# EAGLE design Charger Board_2 (EAGLE 6.3)
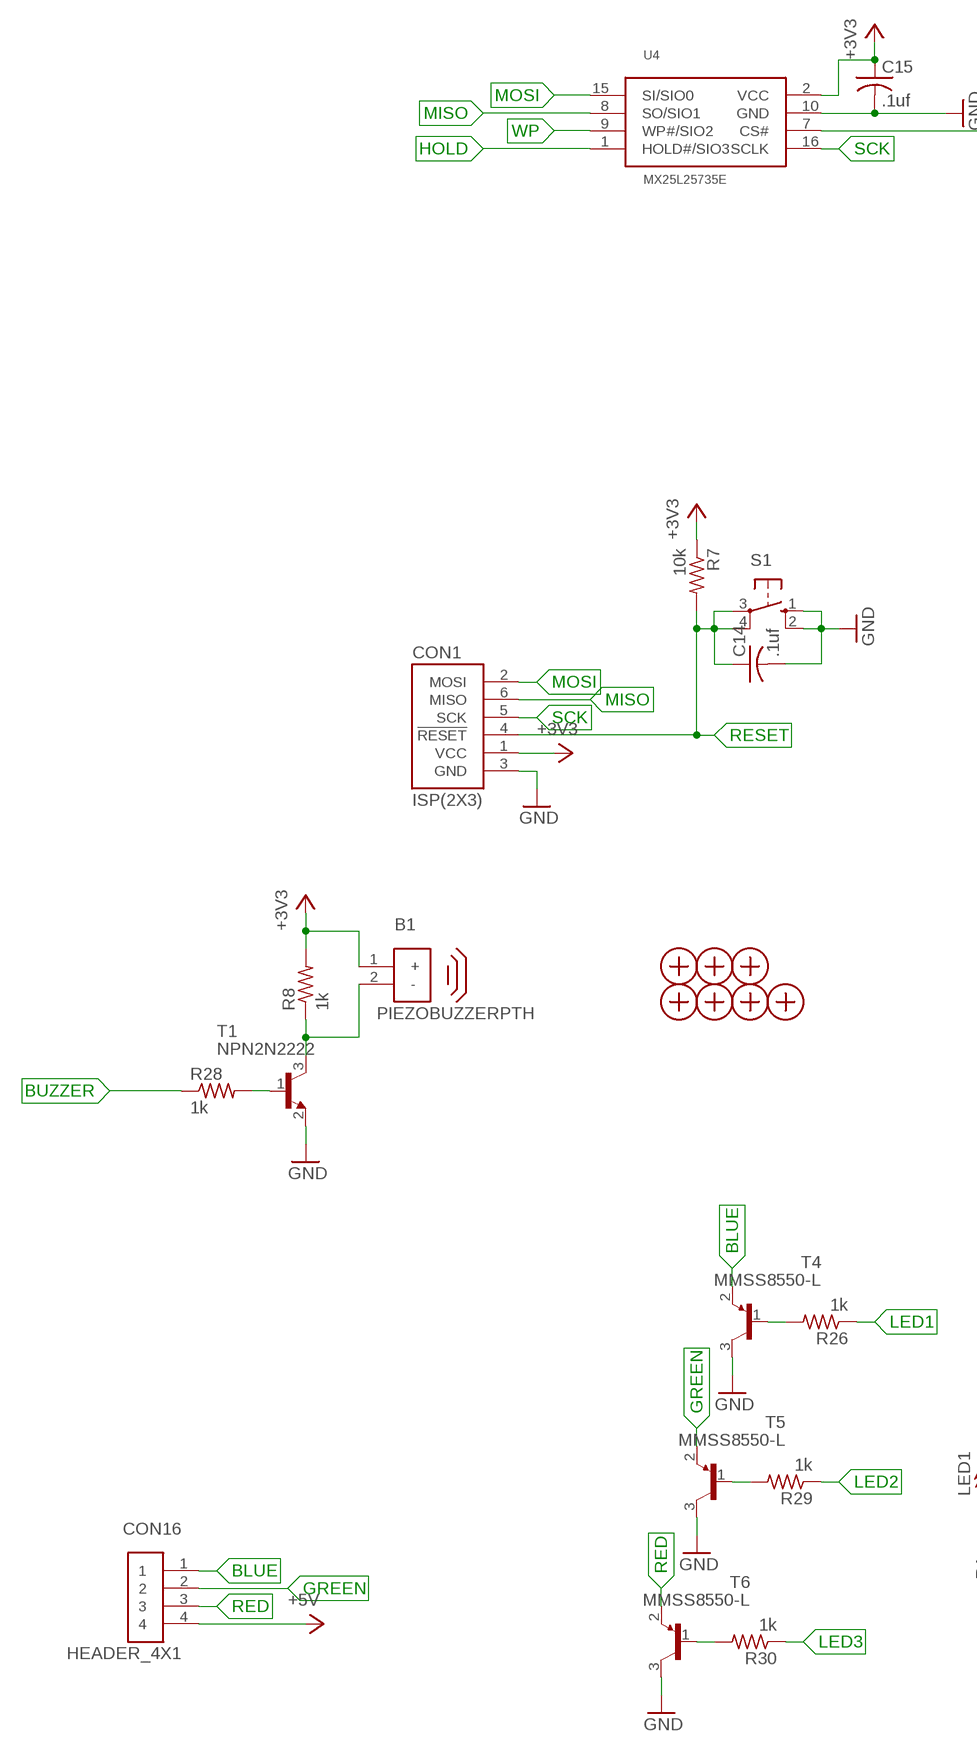
[diagram p0: schematic, sheet 1, part 1 of 2]
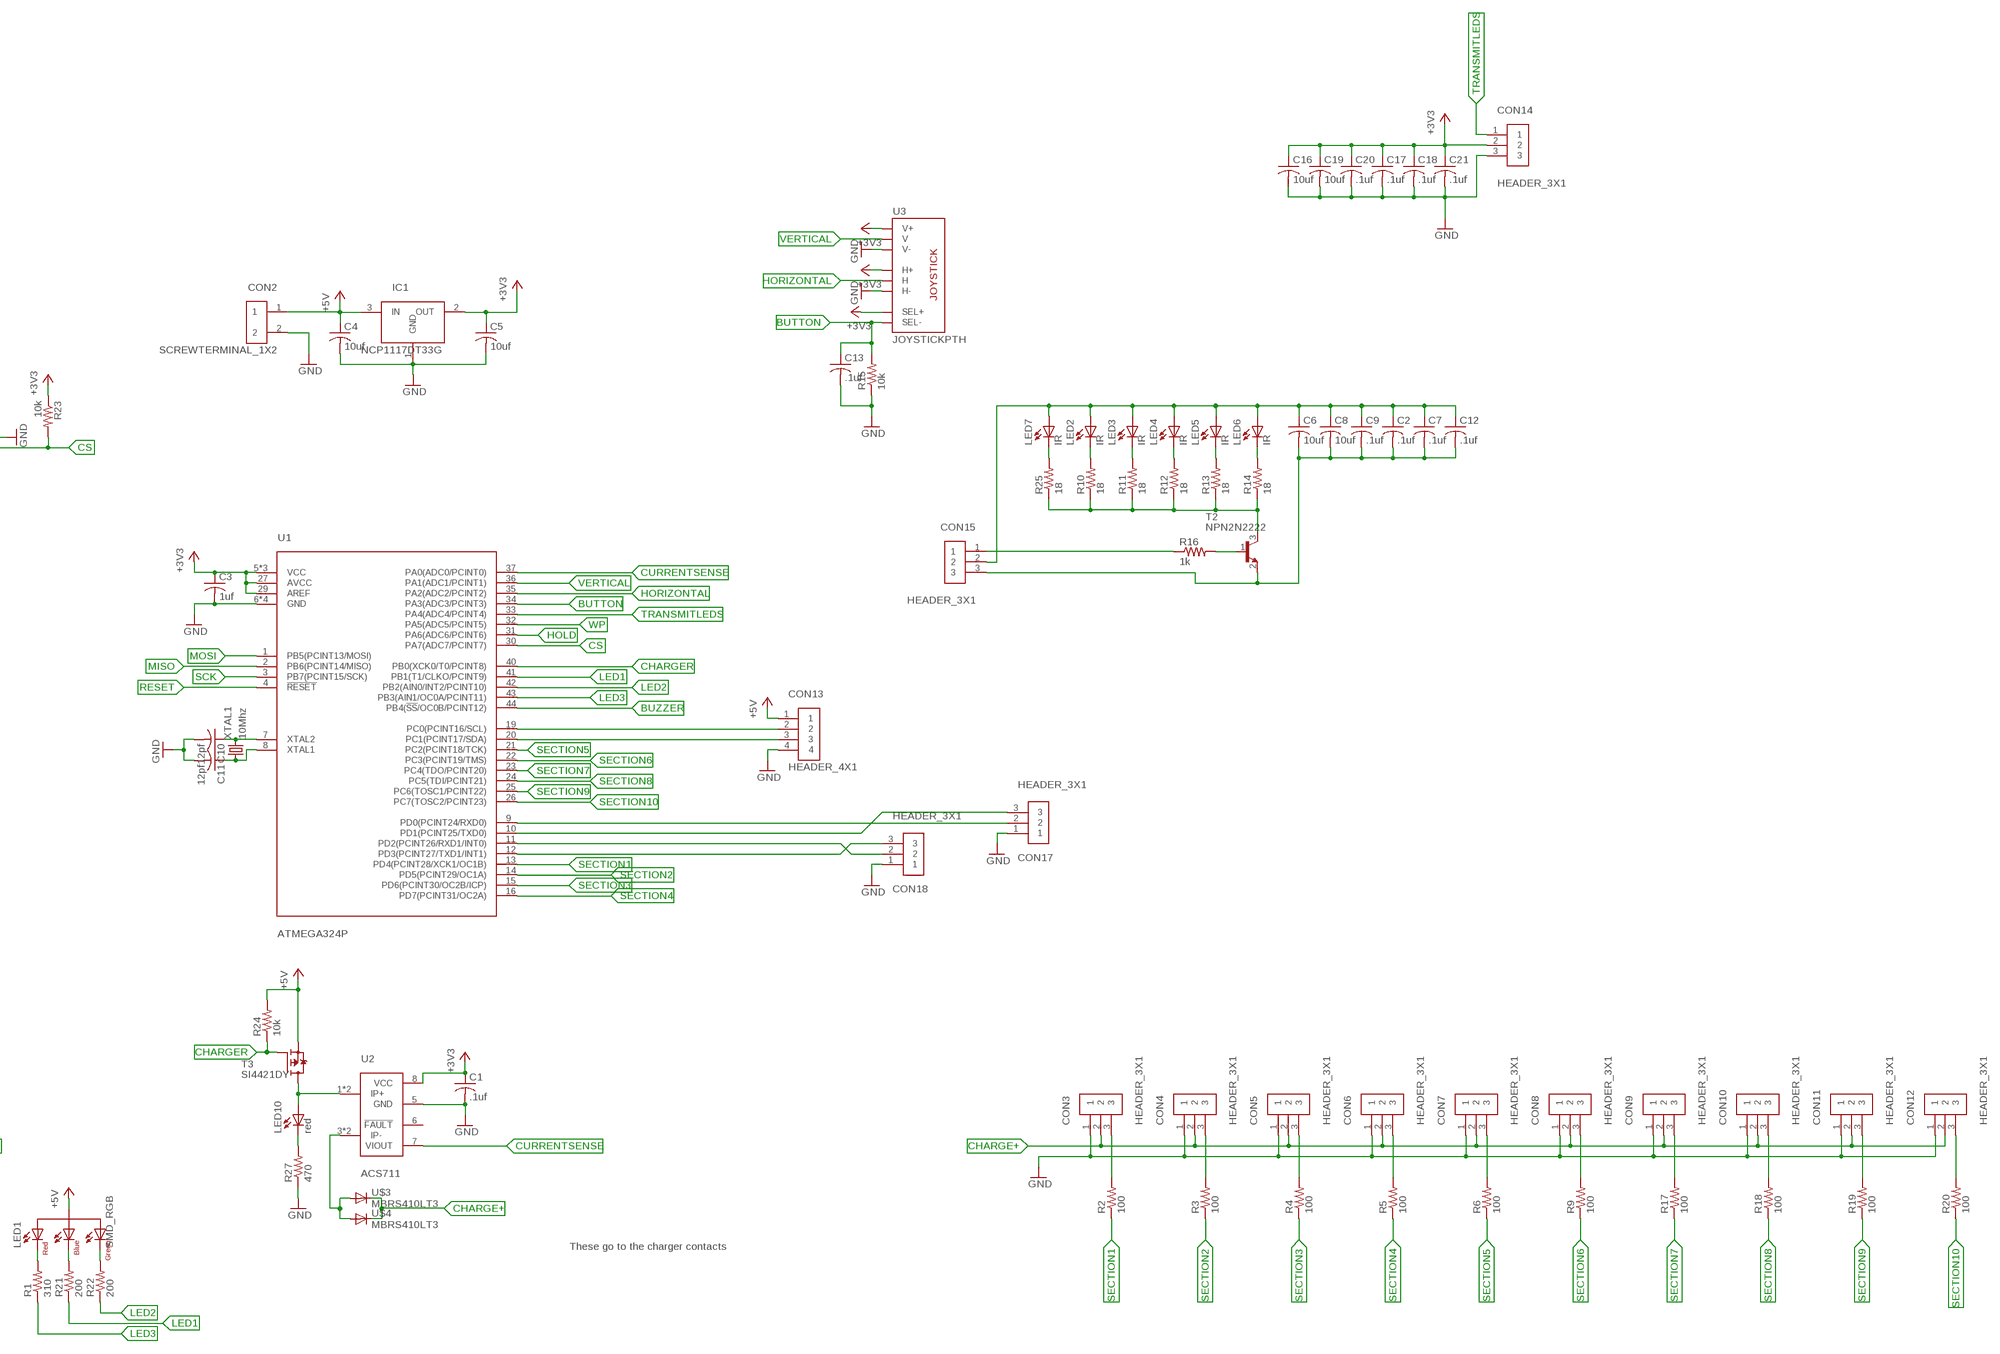
[diagram p1: schematic, sheet 1, part 2 of 2]

## Parts
B1  PIEZOBUZZERPTH  [PIEZOBUZZER]
C1  .1uf  CAP0603  [0603]
C2  .1uf  CAP0603  [0603]
C3  1uf  CAP0603  [0603]
C4  10uf  CAP0805  [0805]
C5  10uf  CAP0805  [0805]
C6  10uf  CAP0805  [0805]
C7  .1uf  CAP0603  [0603]
C8  10uf  CAP0805  [0805]
C9  .1uf  CAP0603  [0603]
C10  12pf  CAP0603  [0603]
C11  12pf  CAP0603  [0603]
C12  .1uf  CAP0603  [0603]
C13  .1uf  CAP0603  [0603]
C14  .1uf  CAP0603  [0603]
C15  .1uf  CAP0603  [0603]
C16  10uf  CAP0805  [0805]
C17  .1uf  CAP0603  [0603]
C18  .1uf  CAP0603  [0603]
C19  10uf  CAP0805  [0805]
C20  .1uf  CAP0603  [0603]
C21  .1uf  CAP0603  [0603]
CON1  ISP(2X3)  [PINHEADER(2X3)]
CON2  SCREWTERMINAL_1X2  [SCREWTERMINAL_1X2]
CON3  HEADER_3X1  [3PINHEADER_.100"]
CON4  HEADER_3X1  [3PINHEADER_.100"]
CON5  HEADER_3X1  [3PINHEADER_.100"]
CON6  HEADER_3X1  [3PINHEADER_.100"]
CON7  HEADER_3X1  [3PINHEADER_.100"]
CON8  HEADER_3X1  [3PINHEADER_.100"]
CON9  HEADER_3X1  [3PINHEADER_.100"]
CON10  HEADER_3X1  [3PINHEADER_.100"]
CON11  HEADER_3X1  [3PINHEADER_.100"]
CON12  HEADER_3X1  [3PINHEADER_.100"]
CON13  HEADER_4X1  [4PINHEADER_.100"]
CON14  HEADER_3X1  [3PINHEADER_.100"]
CON15  HEADER_3X1  [3PINHEADER_.100"]
CON16  HEADER_4X1  [4PINHEADER_.100"]
CON17  HEADER_3X1  [3PINHEADER_.100"]
CON18  HEADER_3X1  [3PINHEADER_.100"]
H1  MOUNTINGHOLE  [MOUNTINGHOLE]
H2  MOUNTINGHOLE  [MOUNTINGHOLE]
H3  MOUNTINGHOLE  [MOUNTINGHOLE]
H4  MOUNTINGHOLE  [MOUNTINGHOLE]
H5  MOUNTINGHOLE  [MOUNTINGHOLE]
H6  MOUNTINGHOLE  [MOUNTINGHOLE]
H7  MOUNTINGHOLE  [MOUNTINGHOLE]
IC1  NCP1117DT33G  [DPAK]
LED1  SMD_RGB  [PLCC4]
LED2  IR  LED5MMRA  [5MM_LED_RA]
LED3  IR  LED5MMRA  [5MM_LED_RA]
LED4  IR  LED5MMRA  [5MM_LED_RA]
LED5  IR  LED5MMRA  [5MM_LED_RA]
LED6  IR  LED5MMRA  [5MM_LED_RA]
LED7  IR  LED5MMRA  [5MM_LED_RA]
LED10  red  LED0603  [LED0603]
R1  310  RES0603  [0603]
R2  100  RES0603  [0603]
R3  100  RES0603  [0603]
R4  100  RES0603  [0603]
R5  100  RES0603  [0603]
R6  100  RES0603  [0603]
R7  10k  RES0603  [0603]
R8  1k  RES0603  [0603]
R9  100  RES0603  [0603]
R10  18  RES0603  [0603]
R11  18  RES0603  [0603]
R12  18  RES0603  [0603]
R13  18  RES0603  [0603]
R14  18  RES0603  [0603]
R15  10k  RES0603  [0603]
R16  1k  RES0603  [0603]
R17  100  RES0603  [0603]
R18  100  RES0603  [0603]
R19  100  RES0603  [0603]
R20  100  RES0603  [0603]
R21  200  RES0603  [0603]
R22  200  RES0603  [0603]
R23  10k  RES0603  [0603]
R24  10k  RES0603  [0603]
R25  18  RES0603  [0603]
R26  1k  RES0603  [0603]
R27  470  RES0603  [0603]
R28  1k  RES0603  [0603]
R29  1k  RES0603  [0603]
R30  1k  RES0603  [0603]
S1  10-XX  [B3F-10XX]
T1  NPN2N2222  [SOT23]
T2  NPN2N2222  [SOT23]
T3  SI4421DY  [S0-8]
T4  MMSS8550-L  [SOT23]
T5  MMSS8550-L  [SOT23]
T6  MMSS8550-L  [SOT23]
U1  ATMEGA324P  [TQFP44]
U2  ACS711  [8SOIC]
U3  JOYSTICKPTH  [JOYSTICK]
U4  MX25L25735E  [SOIC16R]
U$3  MBRS410LT3  [SMD_DIODE]
U$4  MBRS410LT3  [SMD_DIODE]
XTAL1  10Mhz  NX5032GA-10.000000MHZ  [SMDXTAL]

## Nets
+3V3: B1.1(+) C1.1 C3.1 C5.1 C15.1 C16.1 C17.1 C18.1 C19.1 C20.1 C21.1 CON1.1(VCC) CON14.2 IC1.2(OUT) R7.1 R8.2 R23.1 U1.5(VCC) U1.17(VCC) U1.27(AVCC) U1.29(AREF) U1.38(VCC) U2.8(VCC) U3.B1A(SEL+) U3.H1(H+) U3.V1(V+) U4.2(VCC)
+5V: C4.1 CON2.1 CON13.1 CON16.4 IC1.3(IN) LED1.2(COMMONANODE) R24.2 T3.1(S) T3.2(S) T3.3(S)
BLUE: CON16.1 T4.2(E)
BUTTON: C13.1 R15.2 U1.34(PA3(ADC3/PCINT3)) U3.B2A(SEL-)
BUZZER: R28.1 U1.44(PB4(!SS!/OC0B/PCINT12))
CHARGE+: CON3.2 CON4.2 CON5.2 CON6.2 CON7.2 CON8.2 CON9.2 CON10.2 CON11.2 CON12.2 U$3.2(C) U$4.2(C)
CHARGER: R24.1 T3.4(G) U1.40(PB0(XCK0/T0/PCINT8))
CS: R23.2 U1.30(PA7(ADC7/PCINT7)) U4.7(CS#)
CURRENTSENSE: U1.37(PA0(ADC0/PCINT0)) U2.7(VIOUT)
GND: C1.2 C3.2 C4.2 C5.2 C10.2 C11.2 C13.2 C14.2 C15.2 C16.2 C17.2 C18.2 C19.2 C20.2 C21.2 CON1.3(GND) CON2.2 CON3.1 CON4.1 CON5.1 CON6.1 CON7.1 CON8.1 CON9.1 CON10.1 CON11.1 CON12.1 CON13.4 CON14.3 CON17.1 CON18.1 IC1.1(GND) R15.1 R27.1 S1.1(S) S1.2(S1) T1.2(E) T4.3(C) T5.3(C) T6.3(C) U1.6(GND) U1.18(GND) U1.28(GND) U1.39(GND) U2.5(GND) U3.H3(H-) U3.V3(V-) U4.10(GND)
GREEN: CON16.2 T5.2(E)
HOLD: U1.31(PA6(ADC6/PCINT6)) U4.1(HOLD#/SIO3)
HORIZONTAL: U1.35(PA2(ADC2/PCINT2)) U3.H2(H)
LED1: R21.1 R26.1 U1.41(PB1(T1/CLKO/PCINT9))
LED2: R22.1 R29.1 U1.42(PB2(AIN0/INT2/PCINT10))
LED3: R1.1 R30.1 U1.43(PB3(AIN1/OC0A/PCINT11))
MISO: CON1.6(MISO) U1.2(PB6(PCINT14/MISO)) U4.8(SO/SIO1)
MOSI: CON1.2(MOSI) U1.1(PB5(PCINT13/MOSI)) U4.15(SI/SIO0)
N$1: LED10.2(A) T3.5(D) T3.6(D) T3.7(D) T3.8(D) U2.1(IP+) U2.2(IP+)
N$2: CON15.1 R16.1
N$3: C2.1 C6.1 C7.1 C8.1 C9.1 C12.1 CON15.2 LED2.1(A) LED3.1(A) LED4.1(A) LED5.1(A) LED6.1(A) LED7.1(A)
N$4: CON18.2 U1.11(PD2(PCINT26/RXD1/INT0))
N$5: C2.2 C6.2 C7.2 C8.2 C9.2 C12.2 CON15.3 T2.2(E)
N$6: LED7.2(C) R25.2
N$7: CON17.3 U1.10(PD1(PCINT25/TXD0))
N$8: CON17.2 U1.9(PD0(PCINT24/RXD0))
N$9: B1.2(-) R8.1 T1.3(C)
N$10: R10.1 R11.1 R12.1 R13.1 R14.1 R25.1 T2.3(C)
N$11: R16.2 T2.1(B)
N$12: C10.1 U1.7(XTAL2) XTAL1.2
N$13: LED2.2(C) R10.2
N$14: LED3.2(C) R11.2
N$15: LED4.2(C) R12.2
N$16: LED5.2(C) R13.2
N$17: LED6.2(C) R14.2
N$19: CON18.3 U1.12(PD3(PCINT27/TXD1/INT1))
N$22: LED10.1(C) R27.2
N$23: U2.3(IP-) U2.4(IP-) U$3.1(A) U$4.1(A)
N$24: CON3.3 R2.2
N$25: C11.1 U1.8(XTAL1) XTAL1.1
N$26: R28.2 T1.1(B)
N$27: CON4.3 R3.2
N$28: CON5.3 R4.2
N$29: CON6.3 R5.2
N$30: CON7.3 R6.2
N$31: CON8.3 R9.2
N$32: CON9.3 R17.2
N$33: CON10.3 R18.2
N$34: CON11.3 R19.2
N$35: CON12.3 R20.2
N$36: R26.2 T4.1(B)
N$37: LED1.1(REDCATHODE) R1.2
N$38: LED1.3(BLUECATHODE) R21.2
N$39: LED1.4(GREENCATHODE) R22.2
N$40: R29.2 T5.1(B)
N$41: R30.2 T6.1(B)
RED: CON16.3 T6.2(E)
RESET: C14.1 CON1.4(!RESET) R7.2 S1.3(P) S1.4(P1) U1.4(!RESET)
SCK: CON1.5(SCK) U1.3(PB7(PCINT15/SCK)) U4.16(SCLK)
SCL: CON13.2 U1.19(PC0(PCINT16/SCL))
SDA: CON13.3 U1.20(PC1(PCINT17/SDA))
SECTION1: R2.1 U1.13(PD4(PCINT28/XCK1/OC1B))
SECTION2: R3.1 U1.14(PD5(PCINT29/OC1A))
SECTION3: R4.1 U1.15(PD6(PCINT30/OC2B/ICP))
SECTION4: R5.1 U1.16(PD7(PCINT31/OC2A))
SECTION5: R6.1 U1.21(PC2(PCINT18/TCK))
SECTION6: R9.1 U1.22(PC3(PCINT19/TMS))
SECTION7: R17.1 U1.23(PC4(TDO/PCINT20))
SECTION8: R18.1 U1.24(PC5(TDI/PCINT21))
SECTION9: R19.1 U1.25(PC6(TOSC1/PCINT22))
SECTION10: R20.1 U1.26(PC7(TOSC2/PCINT23))
TRANSMITLEDS: CON14.1 U1.33(PA4(ADC4/PCINT4))
VERTICAL: U1.36(PA1(ADC1/PCINT1)) U3.V2(V)
WP: U1.32(PA5(ADC5/PCINT5)) U4.9(WP#/SIO2)
Unconnected: U2.6(!FAULT)

## Notes on the sheet
- These go to the charger contacts

## Library data of the parts
B1 = Passive:PIEZOBUZZER: Digikey Part Number: 445-2525-1-ND Manufacturer Part Number: PS1240P02BT
C1-C21 = Passive:CAP
CON1 = Mechanical:ISP
CON2 = Mechanical:SCREWTERMINAL_1X2: Digikey Part Number: ED1631-ND Manufacturer Part Number: ED700/2
CON3-CON12 CON14 CON15 CON17 CON18 = Mechanical:HEADER_3X1
CON13 CON16 = Mechanical:HEADER_4X1
H1-H7 = Mechanical:MOUNTINGHOLE
IC1 = PowerIC:NCP1117DT33G: Digikey Part Number: NCP1117DT33GOS-ND Manufacturer Part Number: NCP1117DT33G
LED1 = Passive:SMD_RGB: Digikey Part Number: CLVBA-FKA-CAEDH8BBB7A363CT-ND Manufacturer Part Number: CLVBA-FKA-CAEDH8BBB7A363
LED2-LED7 LED10 = Passive:LED
R1-R30 = Passive:RES
S1 = switch-omron:10-XX: OMRON SWITCH; MPN: B3F-1000; OC_FARNELL: 176432; OC_NEWARK: 36M3542
T1 T2 = Passive:NPN2N2222: Digikey Part Number: 568-1738-1-ND Manufacturer Part Number: PMBT2222A,215
T3 = Passive:SI4421DY: Digikey Part Number: SI4421DY-T1-E3CT-ND Manufacturer Part Number: SI4421DY-T1-E3
T4-T6 = Passive:MMSS8550-L: Manufacturer Part Number: MMSS8550-L-TP Digikey Part Number: MMSS8550-L-TPMSCT-ND
U1 = DigitalIC:ATMEGA324P: Digikey Part Number: ATMEGA324P-20AU-ND Manufacturer Part Number: ATMEGA324P-20AU
U2 = PowerIC:ACS711
U3 = SparkFun:JOYSTICK: Thumb Joystick Joystick commonly found in PS2 controllers. Two pots and a select switch. Footprint proven. Spark Fun Electronics SKU : COM-09032
U4 = DigitalIC:MX25L25735E: Digikey Part Number: 1092-1000-ND Manufacturer Part Number: MX25L25735EMI-12G
U$3 U$4 = Passive:MBRS410LT3: Digikey Part Number: MBRS410LT3GOSCT-ND Manufacturer Part Number: MBRS410LT3G
XTAL1 = Passive:NX5032GA-10.000000MHZ: Digikey Part Number: 644-1033-1-ND Manufacturer Part Number: NX5032GA-10.000000MHZ-LN-CD-1

## Board
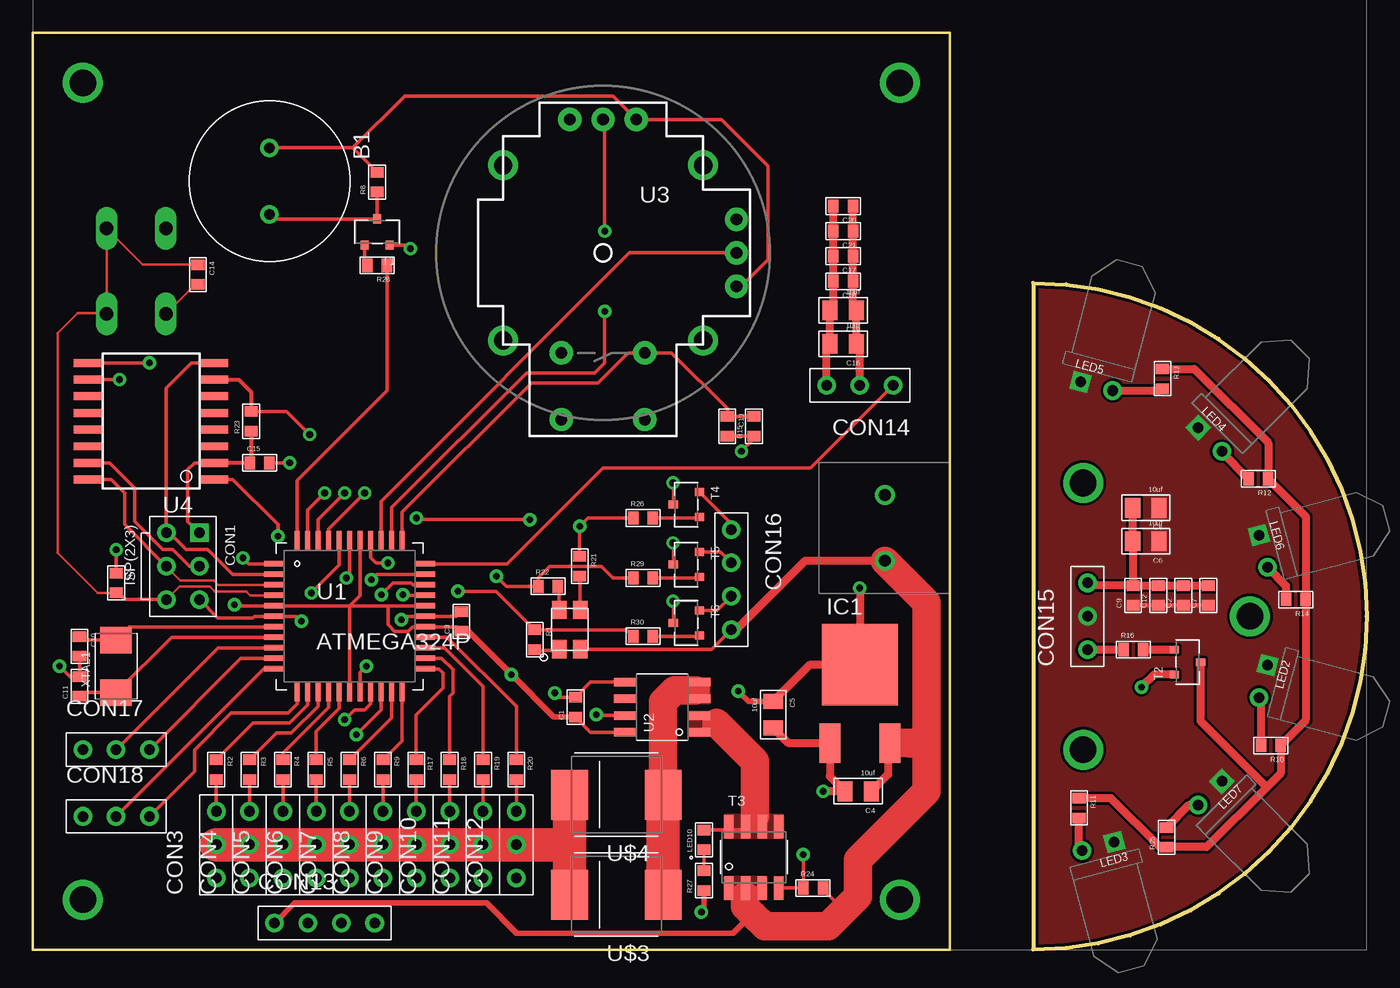
[diagram p2: board, top side]
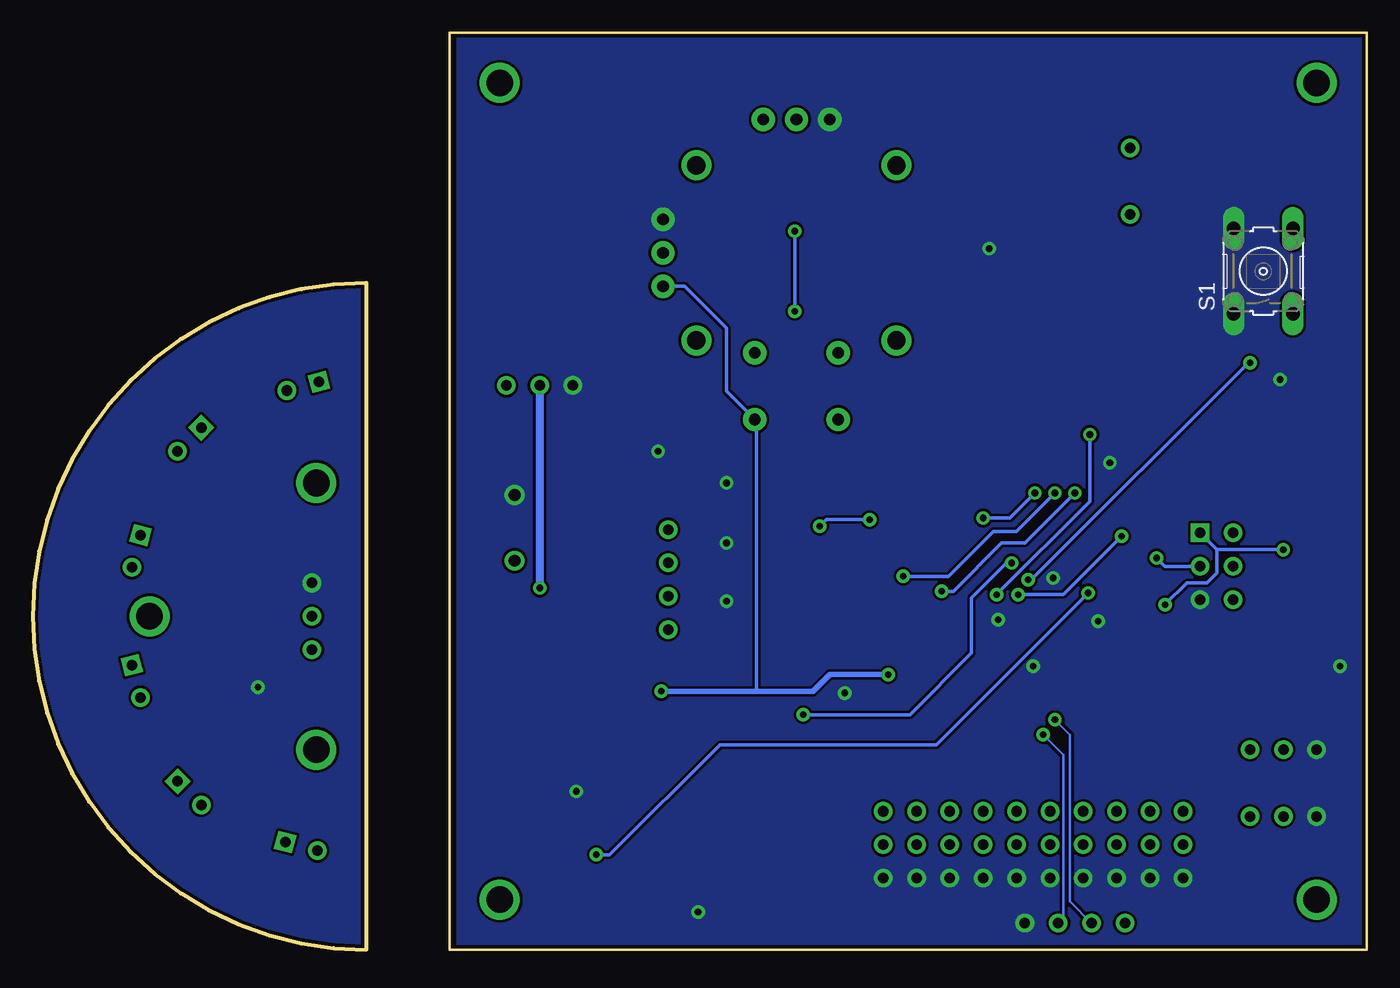
[diagram p3: board, bottom side, seen from below]

Size 101.6 x 69.85 mm. Coordinates in mm from the lower left corner, seen from the top.
Outline: 76.2,50.8 arc-180 76.2,0 76.2,50.8
Outline: 0,0 0,69.85 69.85,69.85 69.85,0 0,0
Copper layers (1*16): Top 0.035mm / dielectric 1.5mm / Bottom 0.035mm
Design rules: minimum track width 8mil, minimum drill 20mil, track to track 8mil, track to pad 8mil, pad to pad 8mil, via to via 8mil, smd to smd 8mil, copper to edge 10mil, drill to drill 8mil, minimum pad ring 12mil, minimum via ring 10mil, stop-mask expansion 4mil, vias tented up to drill 25mil, thermal gap 10mil

### Footprints (pad centres in the part's own frame; a part is rotated, then mirrored left to right if it is on the bottom)
PIEZOBUZZER = drill 0.8: 1 -2.54,0; 2 2.54,0
0603 = smd 0.8 x 1: 1 -0.75,0; 2 0.75,0
0805 = smd 1.15 x 1.5: 1 -1,0; 2 1,0
PINHEADER(2X3) = drill 0.8 square: 1 -2.54,1.27 | drill 0.8: 2 0,1.27; 3 2.54,1.27; 4 2.54,-1.27; 5 0,-1.27; 6 -2.54,-1.27
SCREWTERMINAL_1X2 = drill 0.9: 1 -2.5,0; 2 2.5,0
3PINHEADER_.100" = drill 0.8: 1 -2.54,0; 2 0,0; 3 2.54,0
4PINHEADER_.100" = drill 0.8: 1 -2.54,0; 2 0,0; 3 2.54,0; 4 5.08,0
MOUNTINGHOLE = drill 2.032 pad 2.286: P$2 0,0
DPAK = smd 1.6 x 3: 1 -2.28,-5.99; 3 2.28,-5.99 | smd 5.8 x 6.2: 2 0,0
PLCC4 = smd 1.4 x 1.1: 1 -1.5,0.8; 2 -1.5,-0.8; 3 1.5,-0.8; 4 1.5,0.8
5MM_LED_RA = drill 0.8 square: 1 -1.27,0 | drill 0.8: 2 1.27,0
LED0603 = smd 0.8 x 1: 1 -0.75,0; 2 0.75,0
B3F-10XX = drill 1.016 long: 1 -3.251,2.261; 2 3.251,2.261; 3 -3.251,-2.261; 4 3.251,-2.261
SOT23 = smd 0.6 x 0.7: 1 0.95,1; 2 -0.95,1; 3 0,-1
S0-8 = smd 0.72 x 1.78: 1 -1.905,-2.34; 2 -0.635,-2.34; 3 0.635,-2.34; 4 1.905,-2.34; 5 1.905,2.34; 6 0.635,2.34; 7 -0.635,2.34; 8 -1.905,2.34
TQFP44 = smd 1.5 x 0.406: 1 -5.75,4; 2 -5.75,3.2; 3 -5.75,2.4; 4 -5.75,1.6; 5 -5.75,0.8; 6 -5.75,0; 7 -5.75,-0.8; 8 -5.75,-1.6; 9 -5.75,-2.4; 10 -5.75,-3.2; 11 -5.75,-4; 23 5.75,-4; 24 5.75,-3.2; 25 5.75,-2.4; 26 5.75,-1.6; 27 5.75,-0.8; 28 5.75,0; 29 5.75,0.8; 30 5.75,1.6; 31 5.75,2.4; 32 5.75,3.2; 33 5.75,4 | smd 0.406 x 1.5: 12 -4,-5.75; 13 -3.2,-5.75; 14 -2.4,-5.75; 15 -1.6,-5.75; 16 -0.8,-5.75; 17 0,-5.75; 18 0.8,-5.75; 19 1.6,-5.75; 20 2.4,-5.75; 21 3.2,-5.75; 22 4,-5.75; 34 4,5.75; 35 3.2,5.75; 36 2.4,5.75; 37 1.6,5.75; 38 0.8,5.75; 39 0,5.75; 40 -0.8,5.75; 41 -1.6,5.75; 42 -2.4,5.75; 43 -3.2,5.75; 44 -4,5.75
8SOIC = smd 0.65 x 1.75: 1 -1.905,-2.8; 2 -0.635,-2.8; 3 0.635,-2.8; 4 1.905,-2.8; 5 1.905,2.8; 6 0.635,2.8; 7 -0.635,2.8; 8 -1.905,2.8
JOYSTICK = drill 0.9 pad 1.778: B1A -3.175,12.7; B1B 3.175,12.7; B2A -3.175,7.62; B2B 3.175,7.62 | drill 0.889 pad 1.778: H1 -2.54,-10.16; H2 0,-10.16; H3 2.54,-10.16; V1 -10.16,2.54; V2 -10.16,0; V3 -10.16,-2.54 | drill 1.397 pad 2.286: MOUNT1 -7.62,6.668; MOUNT2 -7.62,-6.668; MOUNT3 7.62,-6.668; MOUNT4 7.62,6.668
SOIC16R = smd 0.6 x 2.2: 1 -4.445,-4.775; 2 -3.175,-4.775; 3 -1.905,-4.775; 4 -0.635,-4.775; 5 0.635,-4.775; 6 1.905,-4.775; 7 3.175,-4.775; 8 4.445,-4.775; 9 4.445,4.8; 10 3.175,4.8; 11 1.905,4.8; 12 0.635,4.8; 13 -0.635,4.8; 14 -1.905,4.8; 15 -3.175,4.8; 16 -4.445,4.8
SMD_DIODE = smd 2.794 x 3.81: 1 -3.568,0; 2 3.568,0
SMDXTAL = smd 2 x 2.4: 1 -2,0; 2 2,0

### Placement (x,y rotation side)
B1  18.03,58.55 270 top
C1  41.34,18.48 90 top
C2  87.63,26.99 90 top
C3  32.64,25.02 90 top
C4  62.87,12.06 180 top
C5  56.39,17.91 270 top
C6  84.77,31.11 180 top
C7  89.53,26.99 90 top
C8  84.77,33.66 180 top
C9  83.82,26.99 90 top
C10  3.56,23.11 270 top
C11  3.56,20.07 90 top
C12  85.72,26.99 90 top
C13  52.9,39.88 270 top
C14  12.57,51.44 270 top
C15  17.27,37.08 0 top
C16  61.72,46.16 180 top
C17  61.72,52.83 180 top
C18  61.72,50.93 180 top
C19  61.72,48.7 180 top
C20  61.72,56.64 180 top
C21  61.72,54.74 180 top
CON1  11.43,29.21 270 top
CON2  64.9,32.13 90 top
CON3  13.97,8 90 top
CON4  16.51,8 90 top
CON5  19.05,8 90 top
CON6  21.59,8 90 top
CON7  24.13,8 90 top
CON8  26.67,8 90 top
CON9  29.21,8 90 top
CON10  31.75,8 90 top
CON11  34.29,8 90 top
CON12  36.83,8 90 top
CON13  20.95,2.03 0 top
CON14  62.99,42.99 180 top
CON15  80.33,25.4 90 top
CON16  53.21,29.46 270 top
CON17  6.35,15.24 0 top
CON18  6.35,10.16 0 top
H1  3.81,3.81 0 top
H2  3.81,66.04 0 top
H3  66.04,66.04 0 top
H4  66.04,3.81 0 top
H5  80.01,35.56 0 top
H6  80.01,15.24 0 top
H7  92.71,25.4 0 top
IC1  62.99,21.72 0 top
LED1  40.89,24.38 90 top
LED2  93.73,20.45 255 top
LED3  81.15,7.87 195 top
LED4  89.67,38.87 315 top
LED5  81.03,42.93 345 top
LED6  93.73,30.35 285 top
LED7  89.67,11.93 225 top
LED10  51.12,8.38 90 top
R1  38.23,23.62 270 top
R2  13.97,13.72 270 top
R3  16.51,13.72 270 top
R4  19.05,13.72 270 top
R5  21.59,13.72 270 top
R6  24.13,13.72 270 top
R7  6.35,27.94 270 top
R8  26.23,58.48 90 top
R9  26.67,13.72 270 top
R10  15  [0603]  94.3,15.56 180 top
R11  15  [0603]  79.69,10.79 270 top
R12  15  [0603]  93.34,35.88 180 top
R13  15  [0603]  86.04,43.5 270 top
R14  15  [0603]  96.2,26.67 180 top
R15  54.93,39.88 90 top
R16  83.82,22.86 0 top
R17  29.21,13.72 270 top
R18  31.75,13.72 270 top
R19  34.29,13.72 270 top
R20  36.83,13.72 270 top
R21  41.66,29.21 270 top
R22  39.24,27.69 0 top
R23  16.64,40.26 90 top
R24  59.44,4.7 0 top
R25  15  [0603]  86.36,8.57 90 top
R26  46.48,32.89 0 top
R27  51.12,5.27 90 top
R28  26.23,52.13 180 top
R29  46.48,28.32 0 top
R30  46.48,23.88 0 top
S1  7.87,51.69 90 bottom
T1  26.23,54.67 180 top
T2  87.95,21.91 90 top
T3  54.93,7.05 0 top
T4  49.78,33.91 270 top
T5  49.78,29.34 270 top
T6  49.78,24.89 270 top
U1  24.13,25.4 0 top
U2  47.94,18.48 90 top
U3  43.43,53.09 180 top
U4  9.02,40.26 90 top
U$3  44.45,4.19 180 top
U$4  44.45,11.81 180 top
XTAL1  6.35,21.59 90 top

### Tracks (layer width: path | path; a pad name or v marks a point on that pad's centre or on a via)
+3V3  (via drill 0.51)
  Top 0.254: 24.13,26.2 U1.5 15.46,26.2 v15.37,26.29 | 24.13,26.2 27.05,26.2 | 27.05,26.2 U1.29 | U2.8 42.49,16.57 C1.1 | C3.1 32.3,24.6 U1.27 28.92,24.6 28.57,24.26 27.56,24.26 27.05,24.77 27.05,26.2 | U1.17 24.13,26.2 | U1.38 24.93,27 24.13,26.2 | U4.2 12.32,37.08 11.81,36.58 11.81,32.64 CON1.1 | B1.1 24.37,61.09 | 24.37,61.09 R8.2 | U3.V1 53.98,50.55 56.01,52.58 56.01,59.69 52.45,63.25 U3.H1 44.2,65.02 28.31,65.02 24.37,61.09 | R7.1 v6.35,30.48
  Top 0.305: C19.1 62.47,48.95 | U4.2 C15.1 16.64,37.2 R23.1
  Top 0.406: C5.1 54.5,18.91 v53.72,19.68 | C3.1 33.13,24.27 v36.45,20.95 39.67,17.73 C1.1
  Top 0.61: C5.1 59.2,21.72 IC1.2 v62.99,27.56 | C19.1 C16.1 62.99,45.9 CON14.2 | 62.47,48.95 C18.1 C17.1 C21.1 C20.1
  Bottom 0.254: U3.V1 51.94,50.55 48.77,47.37 48.77,42.55 U3.B1A 46.48,40.26 46.48,19.68 | v6.35,30.48 11.43,30.48 | 11.43,30.48 CON1.1 | v15.37,26.29 13.72,27.94 12.19,27.94 11.43,28.7 11.43,30.48
  Bottom 0.406: v53.72,19.68 46.48,19.68 42.16,19.68 40.89,20.95 v36.45,20.95
  Bottom 0.61: CON14.2 v62.99,27.56
+5V
  Top 0.203: 65.91,15.75 65.53,15.37 65.14,15.24
  Top 0.254: T3.3 54.35,4.71 54.29,4.76 | T3.2 53.98,4.39 53.98,4.19 | 61.4,3.48 61.4,2.6 | CON16.4 51.71,22.88 LED1.2 | 54.74,2.67 54.86,2.67 | R24.2 60.19,4.58 61.78,2.98
  Top 0.406: CON13.1 19.94,3.56 34.54,3.56 36.83,1.27 53.34,1.27 54.74,2.67
  Top 0.61: IC1.3 65.14,15.24 65.14,13.35 C4.1 | CON16.4 53.58,24.38 58.83,29.63 CON2.1
  Top 2.184: 68.07,15.75 66.78,15.73 66.76,15.75 65.91,15.75 | 54.23,4.06 54.23,3.3 54.86,2.67 55.75,1.78 60.58,1.78 61.4,2.6 61.78,2.98 62.87,4.06 62.87,6.86 68.07,12.06 68.07,15.75 | CON2.1 68.07,26.46 68.07,15.75
  pour Top (no thermals): 55.82,3.87 55.82,5.52 52.77,5.52 52.77,3.87
BLUE
  Top 0.254: T4.2 53.21,32.43 CON16.1
BUTTON
  Top 0.254: R15.2 C13.1 52.9,41.21 48.64,45.47 U3.B2A 45.34,45.47 43.05,43.18 37.97,43.18 28.13,33.34 U1.34
BUZZER
  Top 0.254: U1.44 20.13,35.75 26.98,42.6 R28.1
CHARGE+
  Top 2.54: CON3.2 CON4.2 CON5.2 CON6.2 CON7.2 CON8.2 CON9.2 CON10.2 CON11.2 CON12.2 40.88,8 | 40.88,8 U$4.2 | U$3.2 40.88,8
CHARGER  (via drill 0.51)
  Top 0.254: T3.4 56.84,4.7 R24.1 58.69,7.23 v58.67,7.24 | U1.40 23.33,29.3 v21.21,27.18
  Bottom 0.254: v21.21,27.18 32.77,15.62 49.28,15.62 57.66,7.24 v58.67,7.24
CS  (via drill 0.51)
  Top 0.254: U1.30 28.37,27 v28.19,27.05 | v21.08,39.24 19.32,41.01 R23.2
  Top 0.305: U4.7 15.68,43.43 16.64,42.48 R23.2
  Bottom 0.254: v28.19,27.05 21.08,34.16 v21.08,39.24
CURRENTSENSE  (via drill 0.51)
  Top 0.254: U1.37 25.73,29.9 26.16,29.46 v27.05,29.46 | v42.93,17.91 42.99,17.84 U2.7
  Bottom 0.254: v27.05,29.46 27.43,29.46 30.1,26.8 30.1,22.61 34.8,17.91 v42.93,17.91
GND  (via drill 0.51)
  Top 0.203: C14.2 12.38,50.69 S1.1
  Top 0.254: C10.2 C11.2 2.8,20.82 v2.03,21.59 | CON1.3 14.1,25.27 16.76,25.27 16.89,25.4 U1.6 20.07,25.4 v20.45,25.02 | U2.5 42.49,20.38 C1.2 40.08,19.23 v39.75,19.56 | C3.2 32.25,25.4 U1.28 28.32,25.4 v28.07,25.15 | U1.18 24.93,21.12 v25.4,21.59 | U1.39 24.13,28.57 v23.88,28.32 | T1.2 28.5,53.67 v28.77,53.4 | C13.2 R15.1 54.93,38.92 v53.98,37.97 | 60.45,45.9 C16.2 | U4.10 v6.6,43.43 | C15.2 v19.56,37.08 | T4.3 48.78,35.54 v48.77,35.56 | T5.3 48.78,30.72 v48.77,30.99 | T6.3 48.78,26.53 v48.77,26.54
  Top 0.305: C19.2 60.97,48.95
  Top 0.406: R27.1 51.12,3.05 v50.93,2.86
  Top 0.61: C5.2 57.57,15.73 IC1.1 60.71,13.22 C4.2 60.72,12.08 v60.2,12.06 | C16.2 C19.2 | 60.97,48.95 C18.2 C17.2 C21.2 C20.2 | CON14.3 60.45,45.9
  pour Bottom (no thermals): 0,81.28 69.22,81.28 69.22,0 0,0
GREEN
  Top 0.254: T5.2 52.39,30.29 CON16.2
HOLD  (via drill 0.51)
  Top 0.254: U1.31 28.97,27.8 28.83,27.94 27.43,27.94 v26.54,27.05 | v18.67,31.5 18.67,32.38 15.24,35.81 U4.1
  Bottom 0.254: v26.54,27.05 23.11,27.05 v18.67,31.5
HORIZONTAL  (via drill 0.51)
  Top 0.254: v43.56,54.74 43.56,63.12 U3.H2 | v43.56,48.64 43.56,44.7 42.8,43.94 37.59,43.94 27.33,33.68 U1.35
  Bottom 0.254: v43.56,48.64 v43.56,54.74
LED1  (via drill 0.51)
  Top 0.254: R21.1 v41.66,32.26 42.29,32.89 R26.1 | U1.41 22.53,32.05 v25.27,34.8 | v29.21,32.89 29.34,32.77 v37.85,32.77
  Bottom 0.254: v25.27,34.8 27.18,32.89 v29.21,32.89 | v37.85,32.77 41.15,32.77 v41.66,32.26
LED2  (via drill 0.51)
  Top 0.254: U1.42 21.73,32.78 v23.75,34.8 | v35.31,28.45 36.07,27.69 R22.1 38.49,28.33 39.37,29.21 43.31,29.21 44.2,28.32 R29.1
  Bottom 0.254: v23.75,34.8 26.67,31.88 28.45,31.88 31.88,28.45 v35.31,28.45
LED3  (via drill 0.51)
  Top 0.254: U1.43 20.93,33.5 v22.23,34.8 | v32.38,27.3 35.29,27.3 R1.1 45.24,24.37 R30.1
  Bottom 0.254: v32.38,27.3 31.5,27.3 27.81,30.99 26.04,30.99 v22.23,34.8
MISO
  Top 0.254: U4.8 12.06,44.7 10.16,42.8 CON1.6 10.41,31.75 11.68,30.48 13.34,30.48 15.21,28.6 U1.2
MOSI  (via drill 0.51)
  Top 0.254: U4.15 5.84,37.08 7.75,35.18 7.75,32.64 9.91,30.48 10.67,30.48 11.94,29.21 CON1.2 | U1.1 16.45,29.4 v16,29.84
  Bottom 0.254: v16,29.84 15.37,29.21 CON1.2
N$1
  Top 0.254: 52.07,17.27 51.44,17.27 U2.1 | 54.99,10.16 54.99,9.91 55.75,9.14 53.03,9.14 LED10.2
  Top 2.184: 54.99,10.16 54.99,14.35 52.07,17.27
  pour Top (no thermals): 51.5,18.1 49.97,18.1 49.97,16.32 51.5,16.32
  pour Top (no thermals): 57.09,8.57 57.09,10.22 52.77,10.22 52.77,8.57
N$2
  Top 0.61: CON15.1 R16.1
N$3
  Top 0.305: C7.1 C2.1 C12.1 C9.1
  pour Top (no thermals): 75.25,52.07 75.25,-1.27 80.64,-1.27 90.81,-1.27 94.61,2.54 103.5,11.43 103.5,25.4 103.5,39.37 93.66,49.21 90.81,52.07
N$4
  Top 0.254: U1.11 17.59,21.4 CON18.2
N$5  (via drill 0.51)
  Top 0.61: C8.2 C6.2 83.77,27.79 C9.2 | C9.2 C12.2 C2.2 C7.2 | T2.2 85.41,20.96 v84.45,20 | C9.2 80.53,27.74 CON15.3
  pour Bottom (no thermals): 75.25,52.07 75.25,-1.27 80.64,-1.27 90.81,-1.27 94.61,2.54 103.5,11.43 103.5,25.4 103.5,39.37 93.66,49.21 90.81,52.07
N$6
  Top 0.61: LED7.2 88.07,11.03 R25.2
N$7
  Top 0.254: U1.10 15.85,22.2 CON17.3
N$8
  Top 0.254: U1.9 14.11,23 CON17.2
N$9
  Top 0.254: R8.1 T1.3 18.37,55.67 B1.2
N$10
  Top 0.61: R13.1 88.47,44.25 94.09,38.62 R12.1 96.95,33.02 R14.1 96.95,17.46 R10.1 95.05,13.45 93.98,12.38 | 93.98,12.38 89.42,7.82 R25.1 85.84,7.82 82.12,11.54 R11.1 | T2.3 88.95,17.41 93.98,12.38
N$11
  Top 0.305: T2.1
  Top 0.61: R16.2 T2.1
N$12
  Top 0.254: C10.1 4.04,23.59 XTAL1.2 7.36,24.6 U1.7
N$13
  Top 0.61: LED2.2 93.55,19.07 R10.2
N$14
  Top 0.61: LED3.2 79.69,7.78 R11.2
N$15
  Top 0.61: LED4.2 90.57,37.91 R12.2
N$16
  Top 0.61: LED5.2 85.89,42.6 R13.2
N$17
  Top 0.61: LED6.2 95.45,27.73 R14.2
N$19
  Top 0.254: U1.12 20.13,18.73 19.43,18.03 15.11,18.03 12.32,15.24 12.32,13.59 CON18.3
N$22
  Top 0.254: LED10.1 R27.2
N$23
  Top 0.61: 50.48,19.75 50.74,19.49 U2.3
  Top 2.184: U$4.1 48.02,18.87 48.9,19.75 50.48,19.75
  Top 2.54: U$3.1 U$4.1
  pour Top (no thermals): 51.5,20.64 49.97,20.64 49.97,18.86 51.5,18.86
N$24
  Top 0.254: CON3.3 R2.2
N$25
  Top 0.254: C11.1 4.04,19.59 XTAL1.1 10.56,23.8 U1.8
N$26
  Top 0.254: R28.2 25.28,52.58 T1.1
N$27
  Top 0.254: R3.2 CON4.3
N$28
  Top 0.254: CON5.3 R4.2
N$29
  Top 0.254: R5.2 CON6.3
N$30
  Top 0.254: CON7.3 R6.2
N$31
  Top 0.254: R9.2 CON8.3
N$32
  Top 0.254: CON9.3 R17.2
N$33
  Top 0.254: R18.2 CON10.3
N$34
  Top 0.254: CON11.3 R19.2
N$35
  Top 0.254: R20.2 CON12.3
N$36
  Top 0.254: T4.1 50.72,32.89 R26.2
N$37
  Top 0.254: LED1.1 39.99,22.78 38.32,22.78 R1.2
N$38
  Top 0.254: LED1.3 41.69,27.48 R21.2
N$39
  Top 0.254: LED1.4 40.09,27.59 R22.2
N$40
  Top 0.254: T5.1 50.72,28.32 R29.2
N$41
  Top 0.254: T6.1 50.72,23.88 R30.2
RED
  Top 0.254: T6.2 52.13,25.84 CON16.3
RESET
  Top 0.203: CON1.4 11.18,27.69 13.46,27.69 13.84,27.3 16.26,27.3 16.56,27 U1.4 | R7.2 4.94,27.19 1.91,30.23 1.91,46.99 3.43,48.51 5.54,48.51 S1.3 S1.4 8.37,52.19 C14.1
  Top 0.254: CON1.4 7.12,26.67 R7.2
SCK
  Top 0.203: U1.3 14.11,27.8 13.78,28.13 11.24,28.13 CON1.5
  Top 0.254: CON1.5 6.99,32.38 6.99,34.8 5.97,35.81 U4.16
SCL  (via drill 0.51)
  Top 0.254: U1.19 25.73,18.75 25.27,18.29 24.51,18.29 v23.75,17.53
  Bottom 0.203: v23.75,17.53 22.61,16.38 22.61,3.68 CON13.2
SDA  (via drill 0.51)
  Top 0.254: U1.20 26.53,18.27 v24.64,16.38
  Bottom 0.203: v24.64,16.38 23.11,14.86 23.11,2.41 CON13.3
SECTION1
  Top 0.254: U1.13 20.93,18.64 19.56,17.27 16.78,17.27 R2.1
SECTION2
  Top 0.254: U1.14 21.73,18.55 19.68,16.51 18.55,16.51 R3.1
SECTION3
  Top 0.254: U1.15 22.53,18.47 19.05,14.99 R4.1
SECTION4
  Top 0.254: U1.16 23.33,18.38 21.59,16.64 R5.1
SECTION5
  Top 0.254: U1.21 27.33,17.67 R6.1
SECTION6
  Top 0.254: 26.53,14.36 R9.1 28.13,15.93 U1.22
SECTION7
  Top 0.254: U1.23 30.92,21.4 31.24,21.08 31.24,19.94 29.21,17.91 R17.1
SECTION8
  Top 0.254: U1.24 31.14,22.2 32,21.34 32,19.56 31.75,19.3 R18.1
SECTION9
  Top 0.254: U1.25 31.36,23 34.29,20.07 R19.1
SECTION10
  Top 0.254: U1.26 31.57,23.8 36.83,18.54 R20.1
TRANSMITLEDS
  Top 0.254: U1.33 36.13,29.4 43.43,36.7 59.24,36.7 CON14.1
VERTICAL
  Top 0.254: U3.V2 45.47,53.09 26.53,34.15 U1.36
WP  (via drill 0.51)
  Top 0.254: U1.32 26.19,28.6 v25.78,28.19 | v8.89,44.7 U4.9
  Bottom 0.254: v25.78,28.19 25.53,28.19 9.02,44.7 v8.89,44.7